# Altium schematic sheet First_Sheet.SCHDOC
size 421 x 298 mm
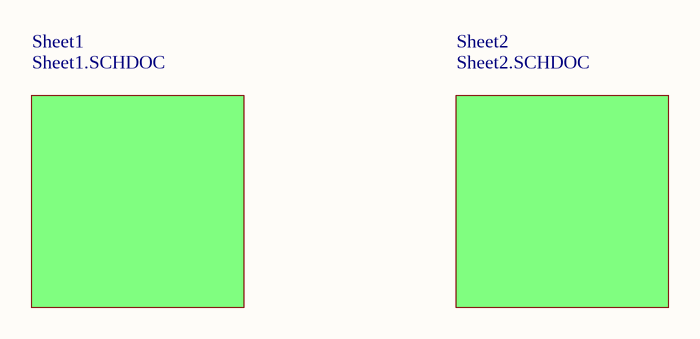
[diagram p0: First_Sheet.SCHDOC]

## Sub-sheets
Sheet1 = Sheet1.SCHDOC: no entries
Sheet2 = Sheet2.SCHDOC: no entries